# Altium schematic sheet IR_Sensors.SchDoc
size A; SheetNumber: 4; SheetTotal: 4
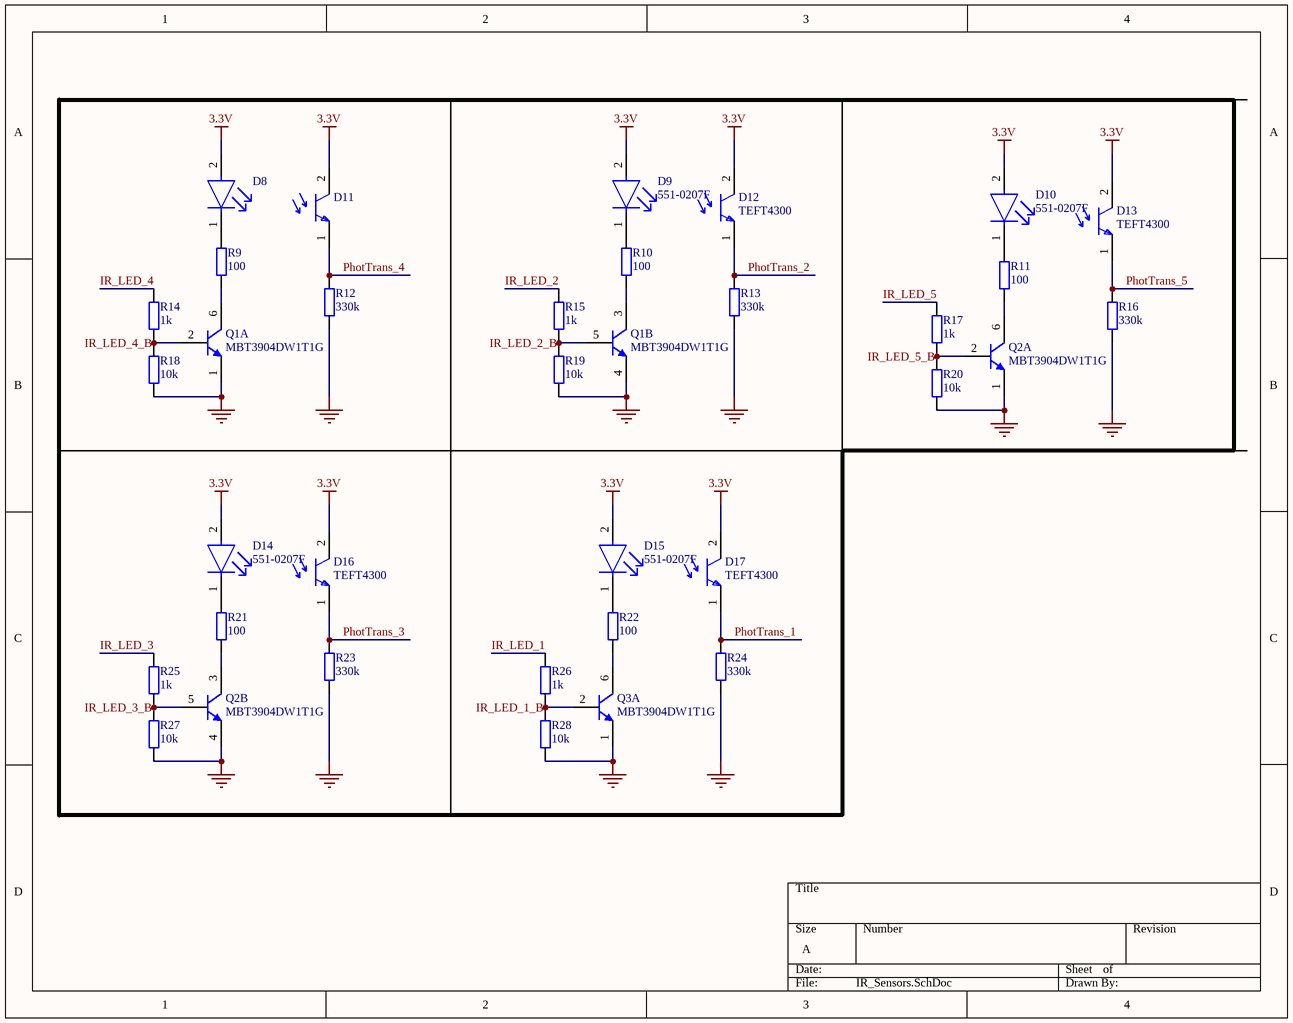
[diagram p0: IR_Sensors.SchDoc]

## Parts
D8  551-0207F  [FP-551-0207F-MFG]  (value not drawn)
D9  551-0207F  [FP-551-0207F-MFG]
D10  551-0207F  [FP-551-0207F-MFG]
D11  TEFT4300  [FP-6_544-5269_01-4-MFG]  (value not drawn)
D12  TEFT4300  [FP-6_544-5269_01-4-MFG]
D13  TEFT4300  [FP-6_544-5269_01-4-MFG]
D14  551-0207F  [FP-551-0207F-MFG]
D15  551-0207F  [FP-551-0207F-MFG]
D16  TEFT4300  [FP-6_544-5269_01-4-MFG]
D17  TEFT4300  [FP-6_544-5269_01-4-MFG]
Q1  MBT3904DW1T1G  [ONSC-SOT-363-6-419B-02_W_V]  (parts A,B of 2)
Q2  MBT3904DW1T1G  [ONSC-SOT-363-6-419B-02_W_V]  (parts A,B of 2)
Q3  MBT3904DW1T1G  [ONSC-SOT-363-6-419B-02_W_V]  (part A of 2)
R9  100  [RES_0603]
R10  100  [RES_0603]
R11  100  [RES_0603]
R12  330k  [RES_0603]
R13  330k  [RES_0603]
R14  1k  [RES_0603]
R15  1k  [RES_0603]
R16  330k  [RES_0603]
R17  1k  [RES_0603]
R18  10k  [RES_0603]
R19  10k  [RES_0603]
R20  10k  [RES_0603]
R21  100  [RES_0603]
R22  100  [RES_0603]
R23  330k  [RES_0603]
R24  330k  [RES_0603]
R25  1k  [RES_0603]
R26  1k  [RES_0603]
R27  10k  [RES_0603]
R28  10k  [RES_0603]

## Nets
3.3V: D8.2(A) D9.2(A) D10.2(A) D11.2(C) D12.2(C) D13.2(C) D14.2(A) D15.2(A) D16.2(C) D17.2(C)
GND: Q1.1(E) Q1.4(E) Q2.1(E) Q2.4(E) Q3.1(E) R12.1 R13.1 R16.1 R18.1 R19.1 R20.1 R23.1 R24.1 R27.1 R28.1
IR_LED_1: R26.2
IR_LED_1_B: Q3.2(B) R26.1 R28.2
IR_LED_2: R15.2
IR_LED_2_B: Q1.5(B) R15.1 R19.2
IR_LED_3: R25.2
IR_LED_3_B: Q2.5(B) R25.1 R27.2
IR_LED_4: R14.2
IR_LED_4_B: Q1.2(B) R14.1 R18.2
IR_LED_5: R17.2
IR_LED_5_B: Q2.2(B) R17.1 R20.2
PhotTrans_1: D17.1(E) R24.2
PhotTrans_2: D12.1(E) R13.2
PhotTrans_3: D16.1(E) R23.2
PhotTrans_4: D11.1(E) R12.2
PhotTrans_5: D13.1(E) R16.2
NetD8_1: D8.1(C) R9.2
NetD9_1: D9.1(C) R10.2
NetD10_1: D10.1(C) R11.2
NetD14_1: D14.1(C) R21.2
NetD15_1: D15.1(C) R22.2
NetQ1_3: Q1.3(C) R10.1
NetQ1_6: Q1.6(C) R9.1
NetQ2_3: Q2.3(C) R21.1
NetQ2_6: Q2.6(C) R11.1
NetQ3_6: Q3.6(C) R22.1

## Library data of the parts
D8-D10 D14 D15 = CMP-15384-000011-1: LED 3MM HIGH EFF GREEN; Viewing Angle: 45°; Lens Size: 5mm; Dominant Wavelength: 563nm; Test Current: 10mA; Power Dissipation: 75mW; Luminous Intensity: 16mcd; Operating Supply Voltage: 2.1V; Reverse Voltage: 3V; Number of LEDs: 1; Lens Style: Diffused; Element Configuration: Single; Mount: Through Hole; Series: 551; Lead Free: Lead Free; Number of Pins: 2; Width: 4.32mm; Packaging: Bulk; Color: Green; REACH SVHC: No SVHC; Lens Color: Green; Package Quantity: 100; Min Operating Temperature: -25°C; Forward Current: 10mA; Height: 7.11mm; RoHS Compliant: Yes; Illumination Color: Green; Number of Elements: 1; Voltage Rating: 2.1V; Radiation Hardening: No; Length: 4.32mm; Depth: 8.89mm; Forward Voltage: 2.1V; Current: 10mA; Wavelength: 563nm; Orientation: Right Angle; Max Operating Temperature: 85°C
D11-D13 D16 D17 = CMP-00030-39729854-1: TEFT4300 PHOTOTRANSISTOR 3.0MM WIDE VIEW / Phototransistor IR Chip Silicon 925nm 2-Pin T-1; Polarity: NPN; Lens Style: Domed; Max Power Dissipation: 100mW; Viewing Angle: 30°; Collector Emitter Breakdown Voltage: 70V; Number of Elements: 1; Rise Time: 2µs; Dark Current: 200nA; Collector Emitter Saturation Voltage: 300mV; Fall Time: 2.3µs; Max Collector Current: 50mA; Max Operating Temperature: 100°C; Schedule B: 8541407080, 8541407080; Min Operating Temperature: -40°C; Orientation: Top View; Height: 4.5mm; Radiation Hardening: No; Power Consumption: 100mW; RoHS: Compliant; Case/Package: T; Lead Free: Lead Free; REACH SVHC: Unknown; NexarPartId: 39729854; Mount: Through Hole; Wavelength: 925nm; Power Dissipation: 100mW; Number of Channels: 1; Number of Pins: 2; Collector Emitter Voltage (VCEO): 70V; Width: 3.9mm; Length: 3.2mm
Q1-Q3 = CMP-1048-00877-1: Dual General Purpose Transistors, 6-Pin SOT-363, Pb-Free, Tape and Reel; Manufacturer: On Semiconductor; Polarity: Dual NPN; fT Min (MHz): 300; IC Continuous (A): 0.2; DatasheetVersion: Rev. 9; ComponentLink2Description: Datasheet; Mounting Technology: Surface Mount; PackageReference: SOT-363-6-419B-02_W; RoHS: TRUE; ComponentLink1Description: Manufacturer URL; ComponentLink2URL: http://www.onsemi.com/pub_link/Collateral/MBT3904DW1T1-D.PDF; PackageVersion: Rev. W, 01/2006; Packing: Tape and Reel; PartNumber: MBT3904DW1T1G; ComponentLink1URL: http://www.onsemi.com/; ComponentLink3URL: http://www.onsemi.com/pub_link/Collateral/NTJD4001N-D.PDF; ComponentLink3Description: Package Specification; PackageDescription: 6-Pin Small Outline Transistor, Body 2 x 1.25 mm, Pitch 0.65 mm
R9-R28 = RES_0603: Resistor SMD 0603; Manufacturer: *; Manufacturer Part Number: *; Distributor Link: *; LCSC: *